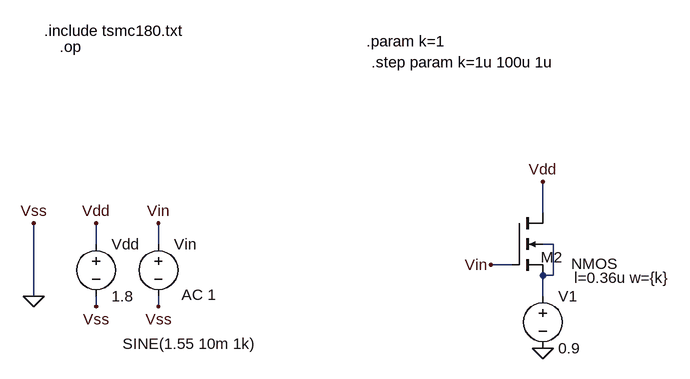
[diagram p0: schematic CD_amp_with_Rout_50 intuitive.asc]
CD_amp_with_Rout_50 intuitive.asc, the LTspice schematic file:
Version 4
SHEET 1 1164 680
WIRE 832 272 832 224
WIRE 144 320 144 288
WIRE 240 320 240 288
WIRE 848 320 832 320
WIRE 784 352 752 352
WIRE 848 368 848 320
WIRE 848 368 832 368
WIRE 48 400 48 288
WIRE 832 400 832 368
WIRE 144 416 144 400
WIRE 240 416 240 400
FLAG 48 400 0
FLAG 48 288 Vss
FLAG 240 288 Vin
FLAG 144 416 Vss
FLAG 240 416 Vss
FLAG 144 288 Vdd
FLAG 832 224 Vdd
FLAG 752 352 Vin
FLAG 832 480 0
SYMBOL voltage 144 304 R0
WINDOW 123 0 0 Left 0
WINDOW 39 0 0 Left 0
SYMATTR InstName Vdd
SYMATTR Value 1.8
SYMBOL voltage 240 304 R0
WINDOW 3 -55 169 Left 2
WINDOW 123 36 94 Left 2
WINDOW 39 0 0 Left 0
SYMATTR Value SINE(1.55 10m 1k)
SYMATTR Value2 AC 1
SYMATTR InstName Vin
SYMBOL nmos4 784 272 R0
WINDOW 0 45 68 Left 2
WINDOW 3 92 78 Left 2
WINDOW 123 96 100 Left 2
SYMATTR InstName M2
SYMATTR Value2 l=0.36u w={k}
SYMBOL voltage 832 384 R0
WINDOW 123 0 0 Left 0
WINDOW 39 0 0 Left 0
SYMATTR InstName V1
SYMATTR Value 0.9
TEXT 64 -8 Left 2 !.include tsmc180.txt
TEXT 88 16 Left 2 !.op
TEXT 560 8 Left 2 !.param k=1
TEXT 568 40 Left 2 !.step param k=1u 100u 1u

The netlist it stands for:
* CD_amp_with_Rout_50 intuitive.asc
Vdd Vdd 0 1.8
Vin Vin 0 SINE(1.55 10m 1k) AC 1
M2 Vdd Vin N001 N001 NMOS l=0.36u w={k}
V1 N001 0 0.9
.model NMOS NMOS
.model PMOS PMOS
.lib standard.mos
.include tsmc180.txt
.op
.param k=1
.step param k=1u 100u 1u
.backanno
.end